# Altium schematic sheet buzzer.SchDoc: Buzzer
size A4; Author: Peter Tanner; SheetNumber: 8; SheetTotal: 9
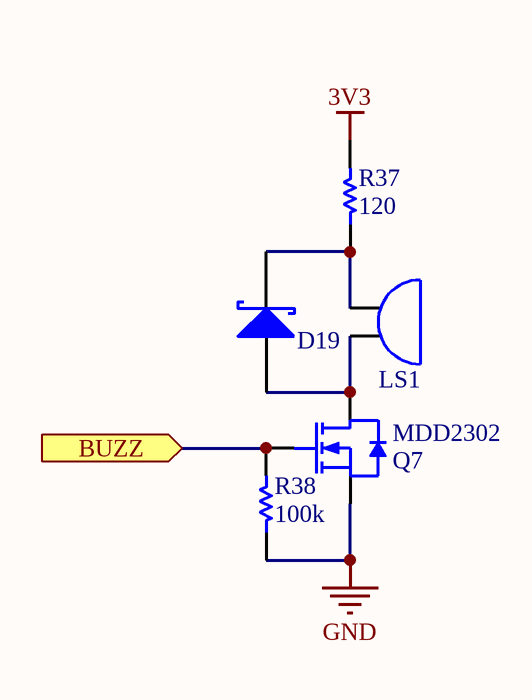
[diagram p0: buzzer.SchDoc]

## Parts
D19  RB521S30T1G  [SODFL160X70-2N]  (value not drawn)
LS1  TMB12A03  [TMB12A03 -Footprint-1]  (value not drawn)
Q7  MDD2302  [SOT95P252X140-3N]
R37  value 120  [RESC1005X04N]  (hidden comment: 0402WGF1200TCE)
R38  value 100k  [RESC1005X04N]  (hidden comment: CRCW0402100KFKEDC)

## Ports
BUZZ (in)

## Nets
3V3: R37.2
GND: Q7.2(S) R38.1
BUZZ: Q7.1(G) R38.2 ; port BUZZ
NetD19_1: D19.1(K) LS1.1 R37.1
NetD19_2: D19.2(A) LS1.2 Q7.3(D)

## Notes on the sheet
- Title:
- Designer:
- Date:
- Size:
- Revision:
- A4
- Sheet:
- 35 Stirling Hwy, Perth WA 6009, Australia

## Library data of the parts
D19 = CMP-00227-5: SCHOTTKY BARRIER DIODE Rectifier Diode, Schottky, 1 Phase, 1 Element, 0.2A, 30V V(RRM), Silicon RB521S-30; Max Reverse Current: 30µA; Power Dissipation: 200mW; Max Forward Surge Current (Ifsm): 1A; Forward Current: 200mA; Forward Voltage: 500mV; Case/Package: SOD-523-2; JLC_PN: C7502702; Technology: SCHOTTKY; Source: JLCPCB(Basic); RoHS Compliant: Yes; Max Repetitive Reverse Voltage (Vrrm): 30V
LS1 = CMP-00694-4: Active (driven circuit included) 85dB@3V,10cm Magnetic 2300Hz Plugin,D=12mm Buzzers ROHS; Operating Voltage: 1.5V~4V; Frequency: 2300Hz; Height: 9.8mm; Diameter (φD): 12mm; Technology Type: Magnetic; Sound Pressure Level (SPL): 85dB@3V,10cm; Oscillator Circuit: Active (driven circuit included); Source: Aliexpress
Q7 = CMP-00703-4: 4A 25mΩ@4.5V null SOT-23 MOSFETs ROHS N CHANNEL; Drain to Source Voltage (Vdss): 20V; Gate to Source Voltage (Vgs): 12V; Input Capacitance: 340pF; Max Power Dissipation: 1.25W; Rds On Max: 28m; Threshold Voltage: 1.2V; JLC_PN: C427390; Type: N channel; Continuous Drain Current (ID): 4A; Case/Package: SOT-23; RoHS Compliant: Unsure; Source: JLCPCB(Basic)
R37 = CMP-00689-3: Fixed Resistor, Metal Glaze/thick Film, 0.0625W, 120ohm, 50V, 1% +/-Tol, 100ppm/Cel, Surface Mount, 0402; Temperature Coefficient: 100ppm/°C; Power Rating: 62.5mW; JLC_PN: C25079; RoHS Compliant: Yes; Tolerance: 1%; Case Code (Imperial): 0402; Source: JLCPCB(Basic)
R38 = CMP-00094-5: RES 100K OHM 1% 1/16W 0402; Power Rating: 62.5mW; Temperature Coefficient: 100ppm/°C; JLC_PN: C25741; Tolerance: 1%; Case Code (Imperial): 0402; RoHS Compliant: Unsure; Source: JLCPCB(Basic)